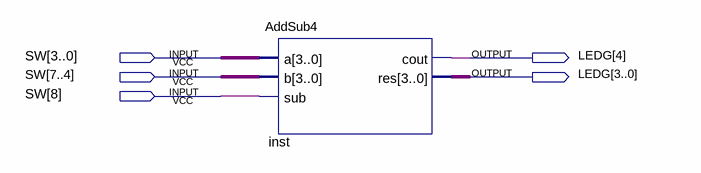
[diagram p0: schematic sheet]
// Quartus schematic AdderDemo.bdf as structural Verilog: 1 symbols, 5 pins
module AdderDemo (
  input  [8:0] SW,
  output [4:0] LEDG
);

  AddSub4 inst (.a(SW[3:0]), .b(SW[7:4]), .sub(SW[8]), .cout(LEDG[4]), .res(LEDG[3:0]));
endmodule
